# Altium project MZ7XB_Fun.PrjPCB
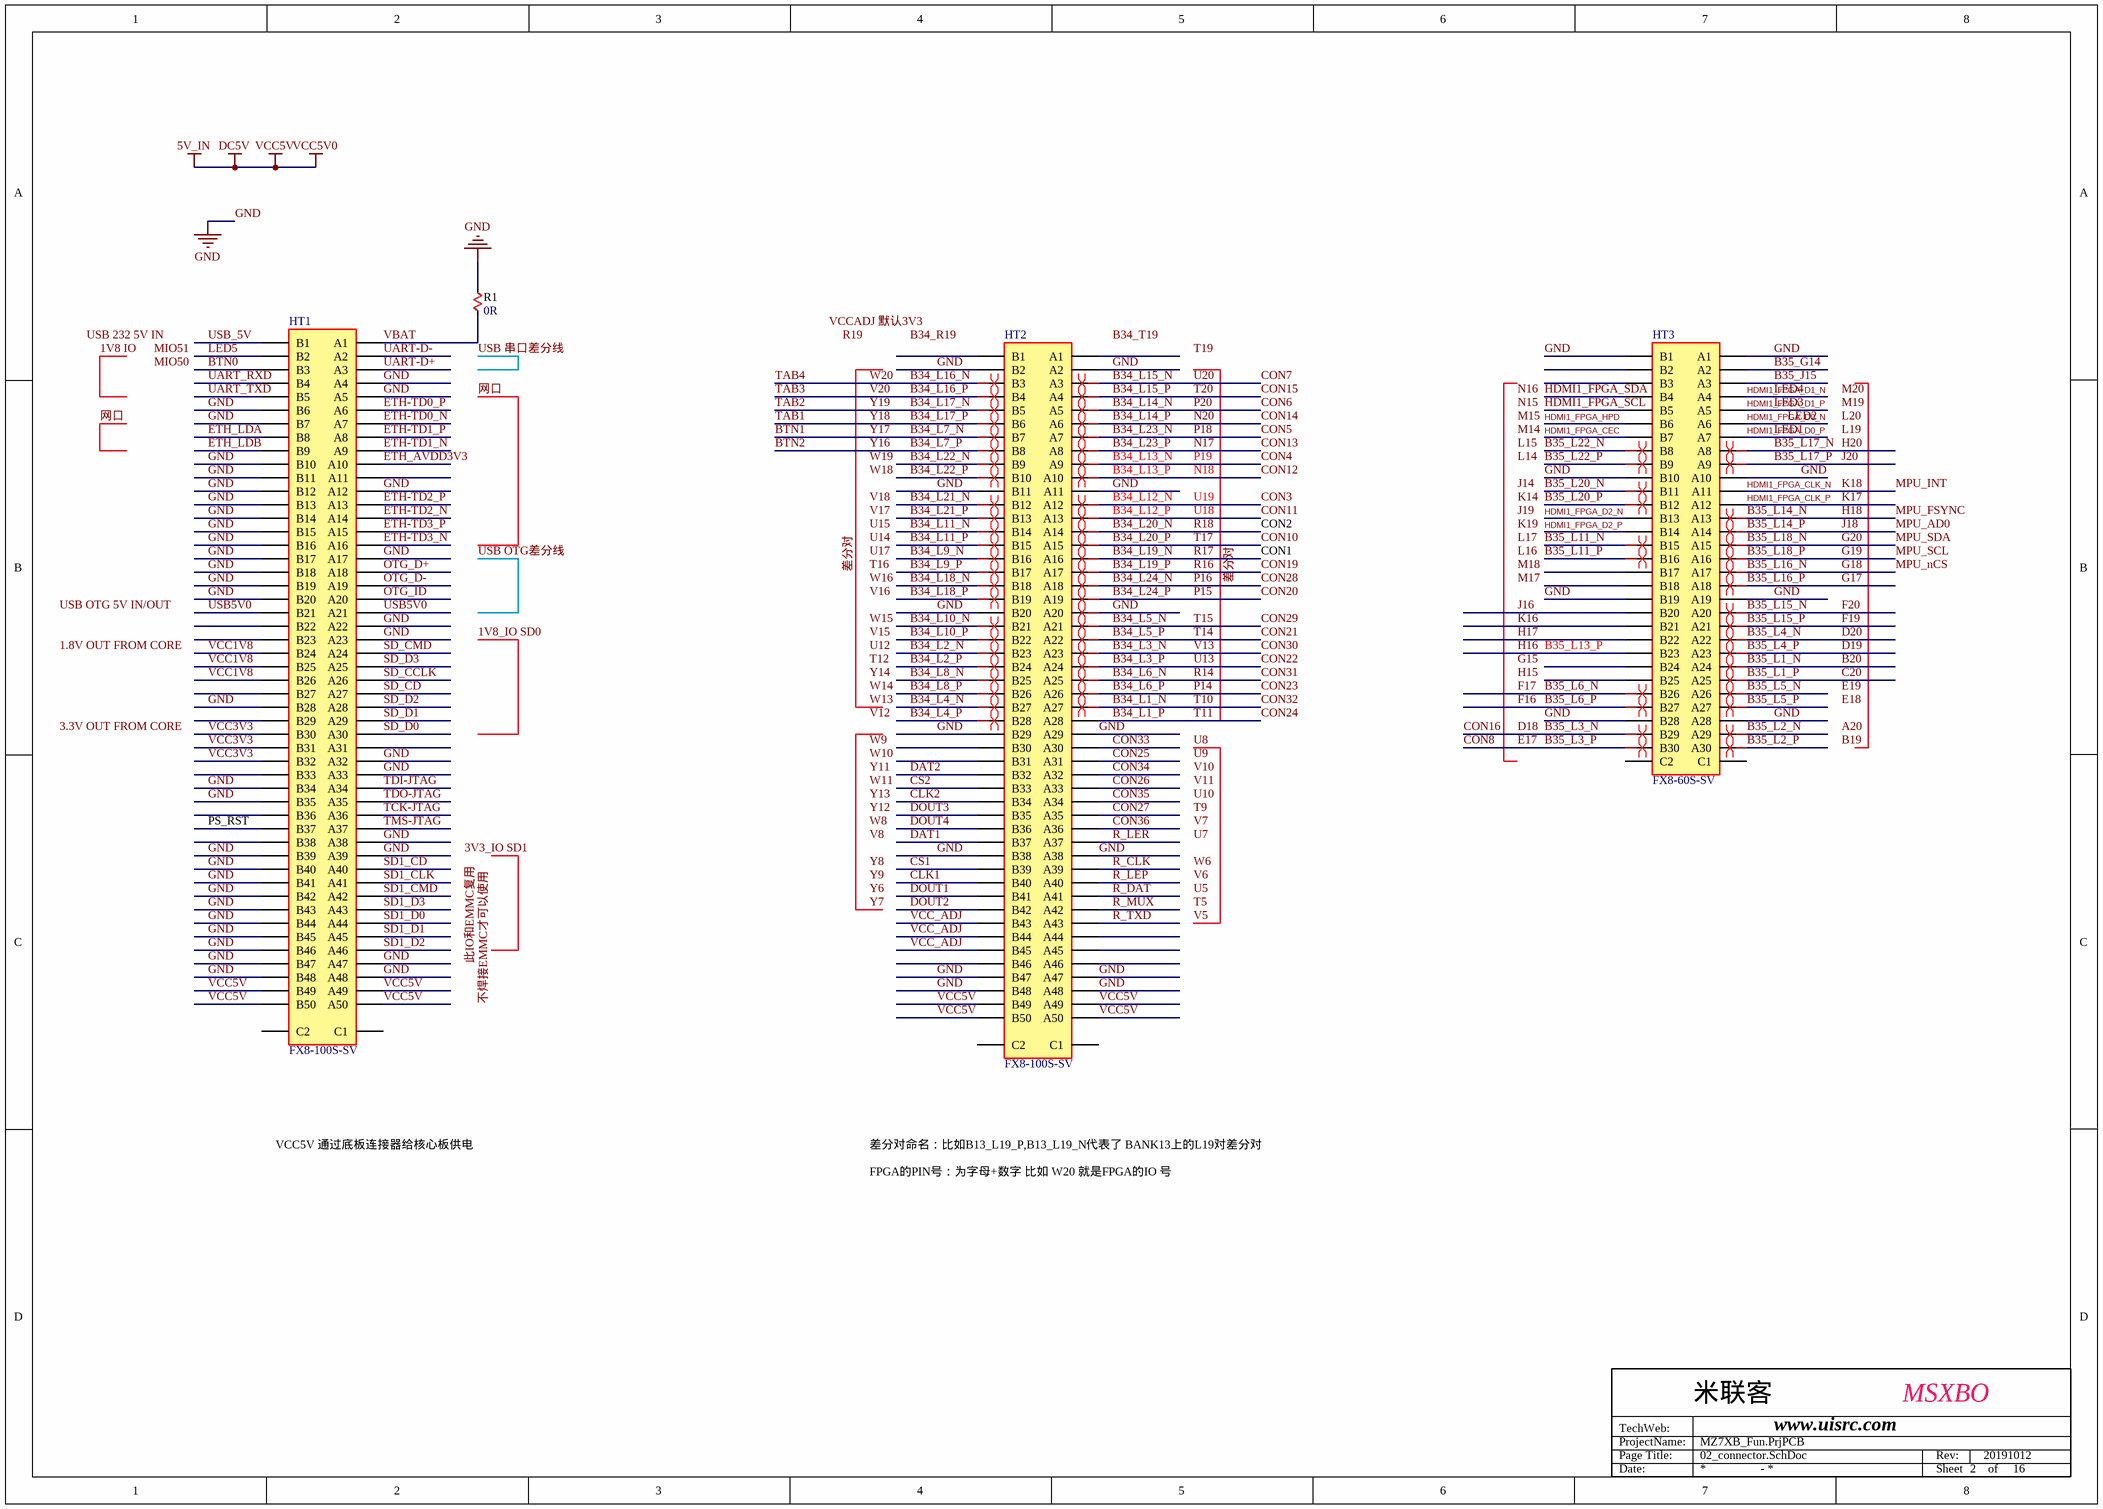
[diagram p0: 02_connector.SchDoc]
11 sheets, 87 parts. Net scope: global (net labels, ports and power ports of the same name join across sheets).
Board files: new.PcbDoc, new - 备份_未布线版本.PcbDoc
Sheets:
  02_connector.SchDoc
  05_USB_JTAG.SchDoc
  06_TF_CARD.SchDoc
  07_PS_ETH_RJ45.SchDoc
  11_BTN_LED_GPIO.SchDoc
  12_PLCLK_100M.SchDoc
  13_CEP.SchDoc
  Sheet1.SchDoc
  Sheet2.SchDoc
  10_HDMI_OUT.SchDoc
  15_PMU.SchDoc

## Sheet 02_connector.SchDoc
size A3

### Parts
HT1  FX8-100S-SV  [FX8-100S-SV92]
HT2  FX8-100S-SV  [FX8-100S-SV92]
HT3  FX8-60S-SV  [FX8-60S-SV92]
R1  0R  [R0603]

### Nets
GND: HT1.A4 HT1.A5 HT1.A12 HT1.A17 HT1.A22 HT1.A23 HT1.A32 HT1.A33 HT1.A38 HT1.A39 HT1.A47 HT1.A48 HT1.B6 HT1.B7 HT1.B10 HT1.B11 HT1.B12 HT1.B13 HT1.B14 HT1.B15 HT1.B16 HT1.B17 HT1.B18 HT1.B19 HT1.B20 HT1.B28 HT1.B34 HT1.B35 HT1.B39 HT1.B40 HT1.B41 HT1.B42 HT1.B43 HT1.B44 HT1.B45 HT1.B46 HT1.B47 HT1.B48 HT2.A2 HT2.A11 HT2.A20 HT2.A29 HT2.A38 HT2.A47 HT2.A48 HT2.B2 HT2.B11 HT2.B20 HT2.B29 HT2.B38 HT2.B47 HT2.B48 HT3.A1 HT3.A10 HT3.A19 HT3.A28 HT3.B1 HT3.B10 HT3.B19 HT3.B28 R1.1
VCC3V3: HT1.B30 HT1.B31 HT1.B32
VCC5V: HT1.A49 HT1.A50 HT1.B49 HT1.B50 HT2.A49 HT2.A50 HT2.B49 HT2.B50  [also labelled 5V_IN, DC5V, VCC5V0]
VCC_ADJ: HT2.B43 HT2.B44 HT2.B45
B20: HT3.A24  [also labelled B35_L1_N]
B34_L1_N: HT2.A27  [also labelled CON32, T10]
B34_L1_P: HT2.A28  [also labelled CON24, T11]
B34_L2_N: HT2.B23
B34_L2_P: HT2.B24
B34_L3_N: HT2.A23  [also labelled CON30, V13]
B34_L3_P: HT2.A24  [also labelled CON22, U13]
B34_L4_N: HT2.B27
B34_L4_P: HT2.B28
B34_L5_N: HT2.A21  [also labelled CON29, T15]
B34_L5_P: HT2.A22  [also labelled CON21, T14]
B34_L6_N: HT2.A25  [also labelled CON31, R14]
B34_L6_P: HT2.A26  [also labelled CON23, P14]
B34_L7_N: HT2.B7  [also labelled BTN1, Y17]
B34_L7_P: HT2.B8  [also labelled BTN2, Y16]
B34_L8_N: HT2.B25
B34_L8_P: HT2.B26
B34_L9_N: HT2.B16
B34_L9_P: HT2.B17
B34_L10_N: HT2.B21
B34_L10_P: HT2.B22
B34_L11_N: HT2.B14
B34_L11_P: HT2.B15
B34_L12_N: HT2.A12  [also labelled CON3, U19]
B34_L12_P: HT2.A13  [also labelled CON11, U18]
B34_L13_N: HT2.A9  [also labelled CON4, P19]
B34_L13_P: HT2.A10  [also labelled CON12, N18]
B34_L14_N: HT2.A5  [also labelled CON6, P20]
B34_L14_P: HT2.A6  [also labelled CON14, N20]
B34_L15_N: HT2.A3  [also labelled CON7, U20]
B34_L15_P: HT2.A4  [also labelled CON15, T20]
B34_L16_N: HT2.B3  [also labelled TAB4, W20]
B34_L16_P: HT2.B4  [also labelled TAB3, V20]
B34_L17_N: HT2.B5  [also labelled TAB2, Y19]
B34_L17_P: HT2.B6  [also labelled TAB1, Y18]
B34_L18_N: HT2.B18
B34_L18_P: HT2.B19
B34_L19_N: HT2.A16  [also labelled CON1, R17]
B34_L19_P: HT2.A17  [also labelled CON19, R16]
B34_L20_N: HT2.A14  [also labelled CON2, R18]
B34_L20_P: HT2.A15  [also labelled CON10, T17, 差分对]
B34_L21_N: HT2.B12
B34_L21_P: HT2.B13
B34_L22_N: HT2.B9
B34_L22_P: HT2.B10
B34_L23_N: HT2.A7  [also labelled CON5, P18]
B34_L23_P: HT2.A8  [also labelled CON13, N17]
B34_L24_N: HT2.A18  [also labelled CON28, P16]
B34_L24_P: HT2.A19  [also labelled CON20, P15]
B35_G14: HT3.A2
B35_J15: HT3.A3
B35_L1_P: HT3.A25  [also labelled C20]
B35_L2_N: HT3.A29
B35_L2_P: HT3.A30
B35_L3_N: HT3.B29  [also labelled CON16, D18]
B35_L3_P: HT3.B30  [also labelled CON8, E17]
B35_L4_N: HT3.A22  [also labelled D20]
B35_L4_P: HT3.A23  [also labelled D19]
B35_L5_N: HT3.A26
B35_L5_P: HT3.A27
B35_L6_N: HT3.B26  [also labelled F17]
B35_L6_P: HT3.B27  [also labelled F16]
B35_L11_N: HT3.B15
B35_L11_P: HT3.B16
B35_L13_P: HT3.B23  [also labelled H16]
B35_L14_N: HT3.A13  [also labelled H18, MPU_FSYNC]
B35_L14_P: HT3.A14  [also labelled J18, MPU_AD0]
B35_L15_N: HT3.A20  [also labelled F20]
B35_L15_P: HT3.A21  [also labelled F19]
B35_L16_N: HT3.A17  [also labelled G18, MPU_nCS]
B35_L16_P: HT3.A18  [also labelled G17]
B35_L17_N: HT3.A8  [also labelled H20]
B35_L17_P: HT3.A9  [also labelled J20]
B35_L18_N: HT3.A15  [also labelled G20, MPU_SDA]
B35_L18_P: HT3.A16  [also labelled G19, MPU_SCL]
B35_L20_N: HT3.B11
B35_L20_P: HT3.B12
B35_L22_N: HT3.B8
B35_L22_P: HT3.B9
BTN0: HT1.B3
CLK1: HT2.B40
CLK2: HT2.B34
CON25: HT2.A31
CON26: HT2.A33
CON27: HT2.A35
CON33: HT2.A30
CON34: HT2.A32
CON35: HT2.A34
CON36: HT2.A36
CS1: HT2.B39
CS2: HT2.B33
DAT1: HT2.B37
DAT2: HT2.B32
DOUT1: HT2.B41
DOUT2: HT2.B42
DOUT3: HT2.B35
DOUT4: HT2.B36
ETH-TD0_N: HT1.A7
ETH-TD0_P: HT1.A6
ETH-TD1_N: HT1.A9
ETH-TD1_P: HT1.A8
ETH-TD2_N: HT1.A14
ETH-TD2_P: HT1.A13
ETH-TD3_N: HT1.A16
ETH-TD3_P: HT1.A15
ETH_AVDD3V3: HT1.A10
ETH_LDA: HT1.B8
ETH_LDB: HT1.B9
H17: HT3.B22
HDMI1_FPGA_CEC: HT3.B7
HDMI1_FPGA_CLK_N: HT3.A11  [also labelled K18, MPU_INT]
HDMI1_FPGA_CLK_P: HT3.A12  [also labelled K17]
HDMI1_FPGA_D0_N: HT3.A6  [also labelled LED2]
HDMI1_FPGA_D0_P: HT3.A7  [also labelled LED1]
HDMI1_FPGA_D1_N: HT3.A4  [also labelled LED4]
HDMI1_FPGA_D1_P: HT3.A5  [also labelled LED3]
HDMI1_FPGA_D2_N: HT3.B13
HDMI1_FPGA_D2_P: HT3.B14
HDMI1_FPGA_HPD: HT3.B6
HDMI1_FPGA_SCL: HT3.B5
HDMI1_FPGA_SDA: HT3.B4
J16: HT3.B20
K16: HT3.B21
LED5: HT1.B2
OTG_D+: HT1.A18
OTG_D-: HT1.A19
OTG_ID: HT1.A20
PS_RST: HT1.B37
R_CLK: HT2.A39
R_DAT: HT2.A41
R_LEP: HT2.A40
R_LER: HT2.A37
R_MUX: HT2.A42
R_TXD: HT2.A43
SD1_CD: HT1.A40
SD1_CLK: HT1.A41
SD1_CMD: HT1.A42
SD1_D0: HT1.A44
SD1_D1: HT1.A45
SD1_D2: HT1.A46
SD1_D3: HT1.A43
SD_CCLK: HT1.A26
SD_CD: HT1.A27
SD_CMD: HT1.A24
SD_D0: HT1.A30
SD_D1: HT1.A29
SD_D2: HT1.A28
SD_D3: HT1.A25
TCK-JTAG: HT1.A36
TDI-JTAG: HT1.A34
TDO-JTAG: HT1.A35
TMS-JTAG: HT1.A37
UART-D+: HT1.A3
UART-D-: HT1.A2
UART_RXD: HT1.B4
UART_TXD: HT1.B5
USB5V0: HT1.A21 HT1.B21
USB_5V: HT1.B1
VBAT: HT1.A1 R1.2
VCC1V8: HT1.B24 HT1.B25 HT1.B26

Not connected (* = marked no-connect by the designer): HT1 A11 A31 B22 B23 B27 B29 B33 B36 B38 C1 C2; HT2 A1 A44 A45 A46 B1 B30 B31 B46 C1 C2; HT3 B2 B3 B17 B18 B24 B25 C1 C2

### Layout directives
differential pair: B20, B34_L1_N, B34_L2_N, B34_L2_P, B34_L3_N, B34_L3_P, B34_L4_N, B34_L4_P, B34_L5_N, B34_L5_P, B34_L6_N, B34_L6_P, B34_L7_N, B34_L7_P, B34_L8_N, B34_L8_P, B34_L9_N, B34_L9_P, B34_L10_N, B34_L10_P, B34_L11_N, B34_L11_P, B34_L12_N, B34_L12_P, B34_L13_N, B34_L13_P, B34_L14_N, B34_L14_P, B34_L15_N, B34_L15_P, B34_L16_N, B34_L16_P, B34_L17_N, B34_L17_P, B34_L18_N, B34_L18_P, B34_L19_N, B34_L19_P, B34_L20_N, B34_L20_P, B34_L21_N, B34_L21_P, B34_L22_N, B34_L22_P, B34_L23_N, B34_L23_P, B34_L24_N, B34_L24_P, B35_L1_P, B35_L2_N, B35_L2_P, B35_L3_N, B35_L3_P, B35_L4_N, B35_L4_P, B35_L5_N, B35_L5_P, B35_L6_N, B35_L6_P, B35_L11_N, B35_L11_P, B35_L14_N, B35_L14_P, B35_L15_N, B35_L15_P, B35_L16_N, B35_L16_P, B35_L17_N, B35_L17_P, B35_L18_N, B35_L18_P, B35_L20_N, B35_L20_P, B35_L22_N, B35_L22_P, GND

### Notes on the sheet
- VCC5V 通过底板连接器给核心板供电
- 差分对命名：比如B13_L19_P,B13_L19_N代表了 BANK13上的L19对差分对
- FPGA的PIN号：为字母+数字 比如 W20 就是FPGA的IO 号
- ProjectName:
- TechWeb:
- Page Title:
- 米联客
- www.uisrc.com
- MSXBO
- Rev:
- 20191012
- Date:
- -
- Sheet
- 2    of     16
- Labels drawn without touching a wire or pin: 1.8V OUT FROM CORE, 1V8 IO, 1V8_IO SD0, 3.3V OUT FROM CORE, 3V3_IO SD1, A20, B19, B34_R19, B34_T19, E18, E19, G15, H15, J14, J19, K14, K19, L14, L15, L16, L17, L19, L20, M14, M15, M17, M18, M19, M20, MIO50, MIO51, N15, N16, R19, T5, T9, T12, T16, T19, U5, U7, U8, U9, U10, U12, U14, U15, U17, USB 232 5V IN, USB OTG 5V IN/OUT, USB OTG差分线, USB 串口差分线, V5, V6, V7, V8, V10, V11, V12, V15, V16, V17, V18, VCCADJ 默认3V3, W6, W8, W9, W10, W11, W13, W14, W15, W16, W18, W19, Y6, Y7, Y8, Y9, Y11, Y12, Y13, Y14, 不焊接EMMC才可以使用, 差分对, 此IO和EMMC复用, 网口

### Library data of the parts
HT1 HT2 = FX8-100P-SV92
HT3 = FX8-60P-SV92
R1 = RESISTOR: Generic Resistor; Value: 390; Manufacturer: *; DPN: *

## Sheet 05_USB_JTAG.SchDoc
size A3
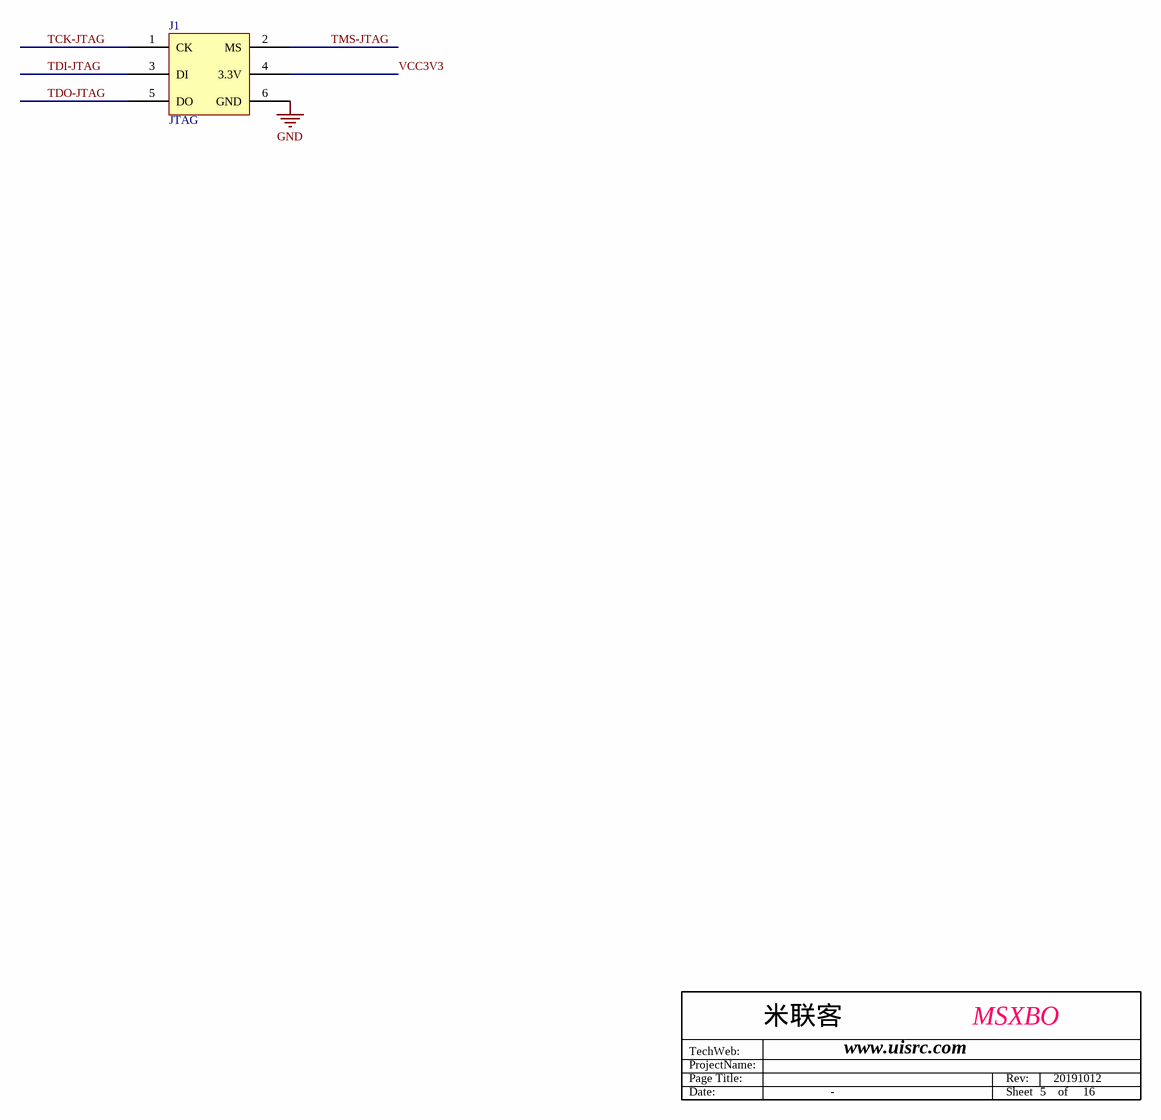
[diagram p1: 05_USB_JTAG.SchDoc]

### Parts
J1  JTAG  [2*3P]

### Nets
GND: J1.6(GND)
VCC3V3: J1.4(3.3V)
TCK-JTAG: J1.1(CK)
TDI-JTAG: J1.3(DI)
TDO-JTAG: J1.5(DO)
TMS-JTAG: J1.2(MS)

### Notes on the sheet
- ProjectName:
- TechWeb:
- Page Title:
- 米联客
- www.uisrc.com
- MSXBO
- Rev:
- 20191012
- Date:
- -
- Sheet
- 5    of     16

## Sheet 06_TF_CARD.SchDoc
size A4
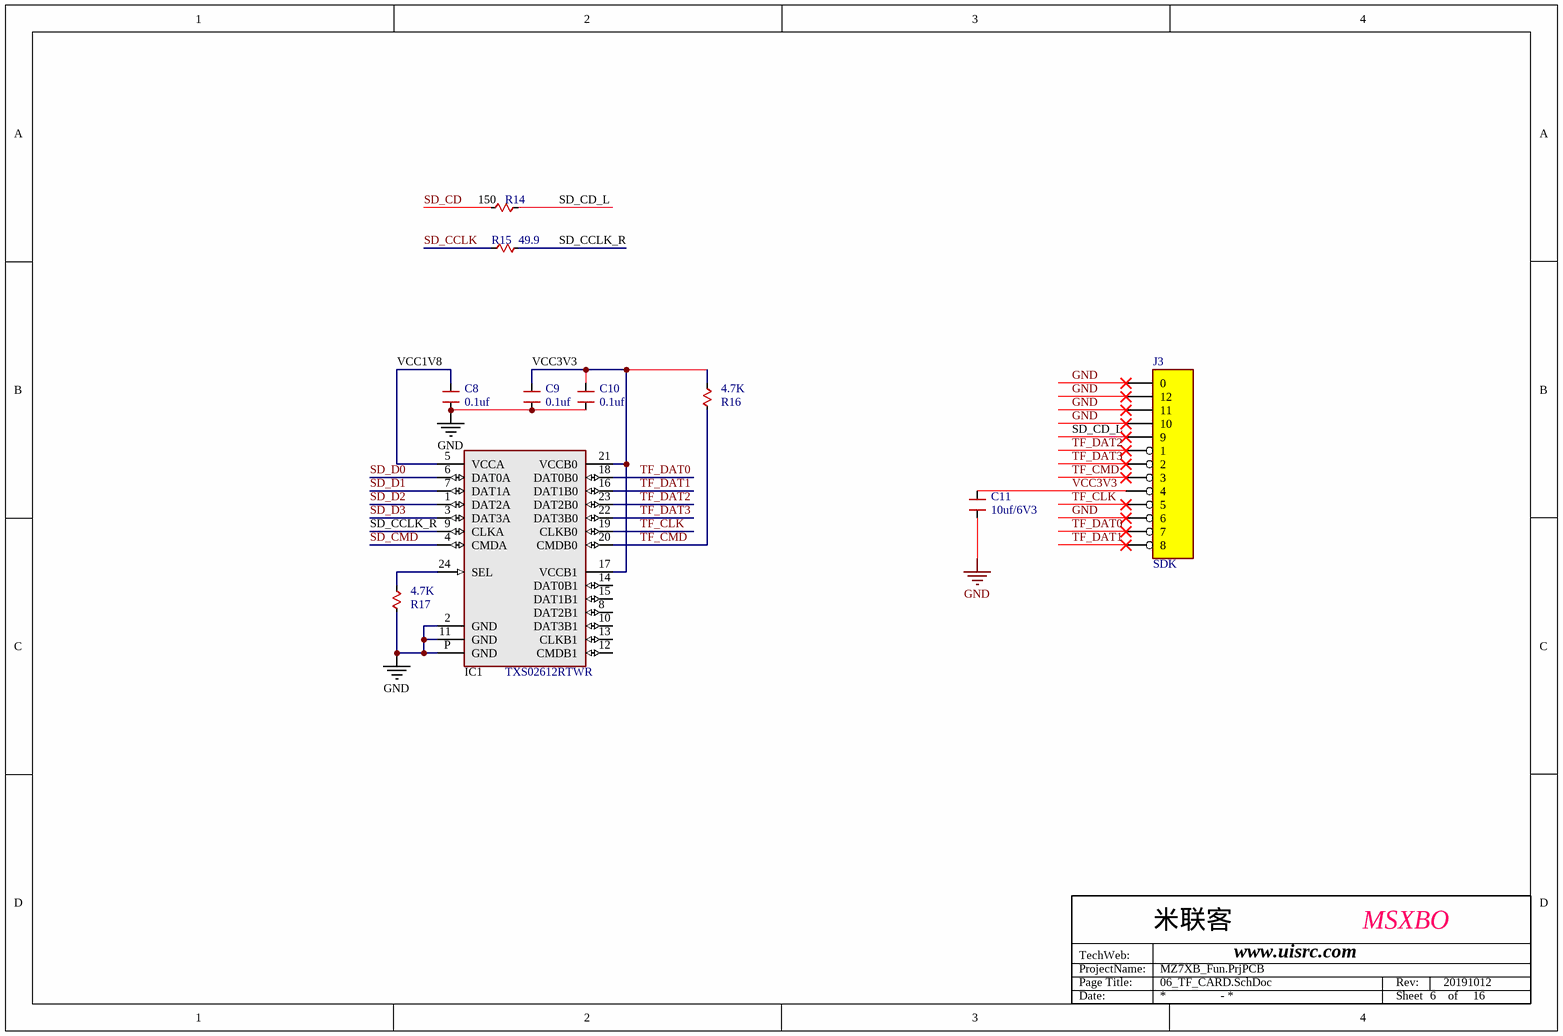
[diagram p2: 06_TF_CARD.SchDoc]

### Parts
(Parts that share a designator on the sheet are numbered #1, #2 ... from top to bottom, then left to right.)
C8  0.1uf  [CAP0603]
C9  0.1uf  [CAP0603]
C10  0.1uf  [CAP0603]
C11  10uf/6V3  [CAP0603]
IC1  TXS02612RTWR  [QFN24]
J3  SDK  [TF_K]
R14  value 150  [R0603]  (hidden comment: 150R)
R15#1  49.9  [R0603]
R16  4.7K  [R0603]
R17#1  4.7K  [R0603]

### Nets
GND: C8.2 C9.2 C10.2 C11.2 IC1.2(GND) IC1.11(GND) IC1.P(GND) J3.0 J3.6 J3.10 J3.11 J3.12 R17#1.1
VCC3V3: C9.1 C10.1 C11.1 IC1.17(VCCB1) IC1.21(VCCB0) J3.4 R16.2
SD_CCLK: R15#1.2
SD_CCLK_R: IC1.9(CLKA) R15#1.1
SD_CD: R14.1
SD_CD_L: J3.9 R14.2
SD_CMD: IC1.4(CMDA)
SD_D0: IC1.6(DAT0A)
SD_D1: IC1.7(DAT1A)
SD_D2: IC1.1(DAT2A)
SD_D3: IC1.3(DAT3A)
TF_CLK: IC1.19(CLKB0) J3.5
TF_CMD: IC1.20(CMDB0) J3.3 R16.1
TF_DAT0: IC1.18(DAT0B0) J3.7
TF_DAT1: IC1.16(DAT1B0) J3.8
TF_DAT2: IC1.23(DAT2B0) J3.1
TF_DAT3: IC1.22(DAT3B0) J3.2
VCC1V8: C8.1 IC1.5(VCCA)
NetIC1_24: IC1.24(SEL) R17#1.2

Not connected (* = marked no-connect by the designer): IC1 8(DAT2B1) 10(DAT3B1) 12(CMDB1) 13(CLKB1) 14(DAT0B1) 15(DAT1B1)

### Notes on the sheet
- ProjectName:
- TechWeb:
- Page Title:
- 米联客
- www.uisrc.com
- MSXBO
- Rev:
- 20191012
- Date:
- -
- Sheet
- 6    of     16

### Library data of the parts
C8-C10 = CAPACITOR: Generic Capacitor; DPN: *; Manufacturer: *; Value: 0.1uF
C11 = CAPACITOR: Generic Capacitor; Value: 4.7uF; DPN: *; Manufacturer: *
IC1 = TXS02612: SDIO Port Expander with Voltage-Level Translation; Manufacturer: Texas Instruments; DPN: *
J3 = SD
R14 R16 R17#1 = RESISTOR: Generic Resistor; Manufacturer: *; DPN: *
  R16 R17#1: Value: 4.7K
R15#1 = RESISTOR: LoadStatus: Load; Manufacturer: *; DPN: *; Value: 49.9

## Sheet 07_PS_ETH_RJ45.SchDoc
size A4
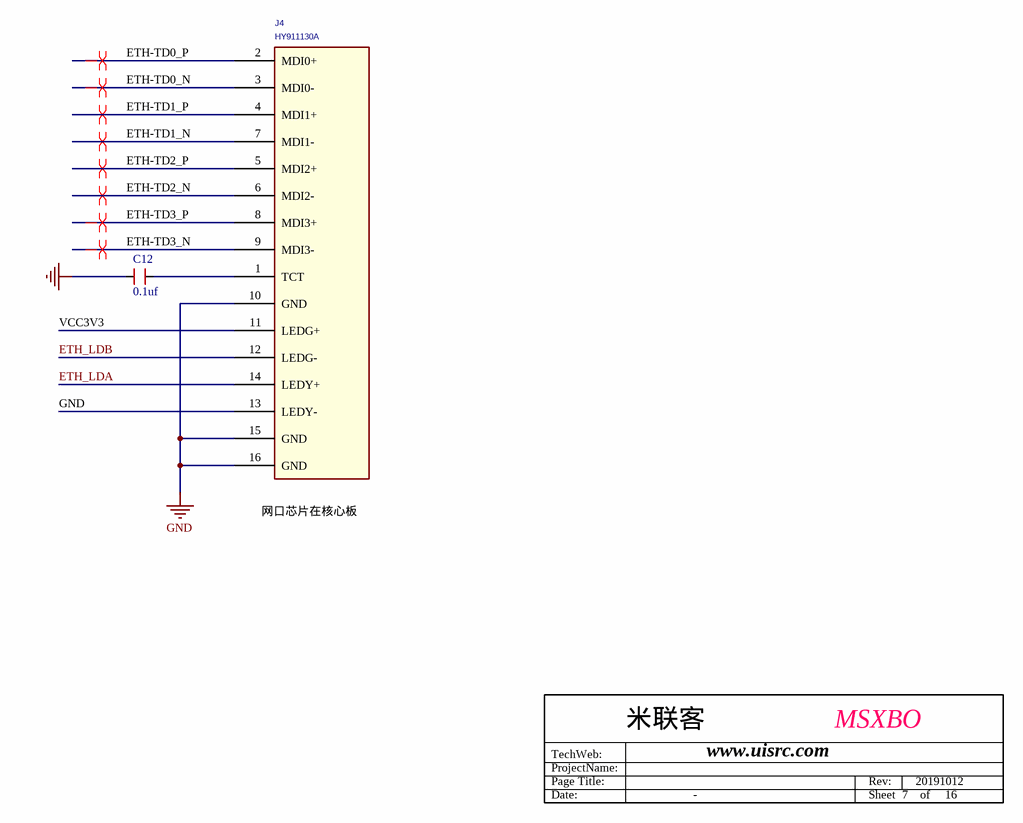
[diagram p3: 07_PS_ETH_RJ45.SchDoc]

### Parts
C12  0.1uf  [CAP0603]
J4  HY911130A  [HY911130A]

### Nets
GND: C12.1 J4.10(GND) J4.13(LEDY-) J4.15(GND) J4.16(GND)
VCC3V3: J4.11(LEDG+)
ETH-TD0_N: J4.3(MDI0-)
ETH-TD0_P: J4.2(MDI0+)
ETH-TD1_N: J4.7(MDI1-)
ETH-TD1_P: J4.4(MDI1+)
ETH-TD2_N: J4.6(MDI2-)
ETH-TD2_P: J4.5(MDI2+)
ETH-TD3_N: J4.9(MDI3-)
ETH-TD3_P: J4.8(MDI3+)
ETH_LDA: J4.14(LEDY+)
ETH_LDB: J4.12(LEDG-)
NetC12_2: C12.2 J4.1(TCT)

### Layout directives
differential pair: ETH-TD0_N, ETH-TD0_P, ETH-TD1_N, ETH-TD1_P, ETH-TD2_N, ETH-TD2_P, ETH-TD3_N, ETH-TD3_P

### Notes on the sheet
- (near J4) 网口芯片在核心板
- ProjectName:
- TechWeb:
- Page Title:
- 米联客
- www.uisrc.com
- MSXBO
- Rev:
- 20191012
- Date:
- -
- Sheet
- 7    of     16

### Library data of the parts
C12 = CAPACITOR: Generic Capacitor; DPN: *; Manufacturer: *

## Sheet 11_BTN_LED_GPIO.SchDoc
size A3
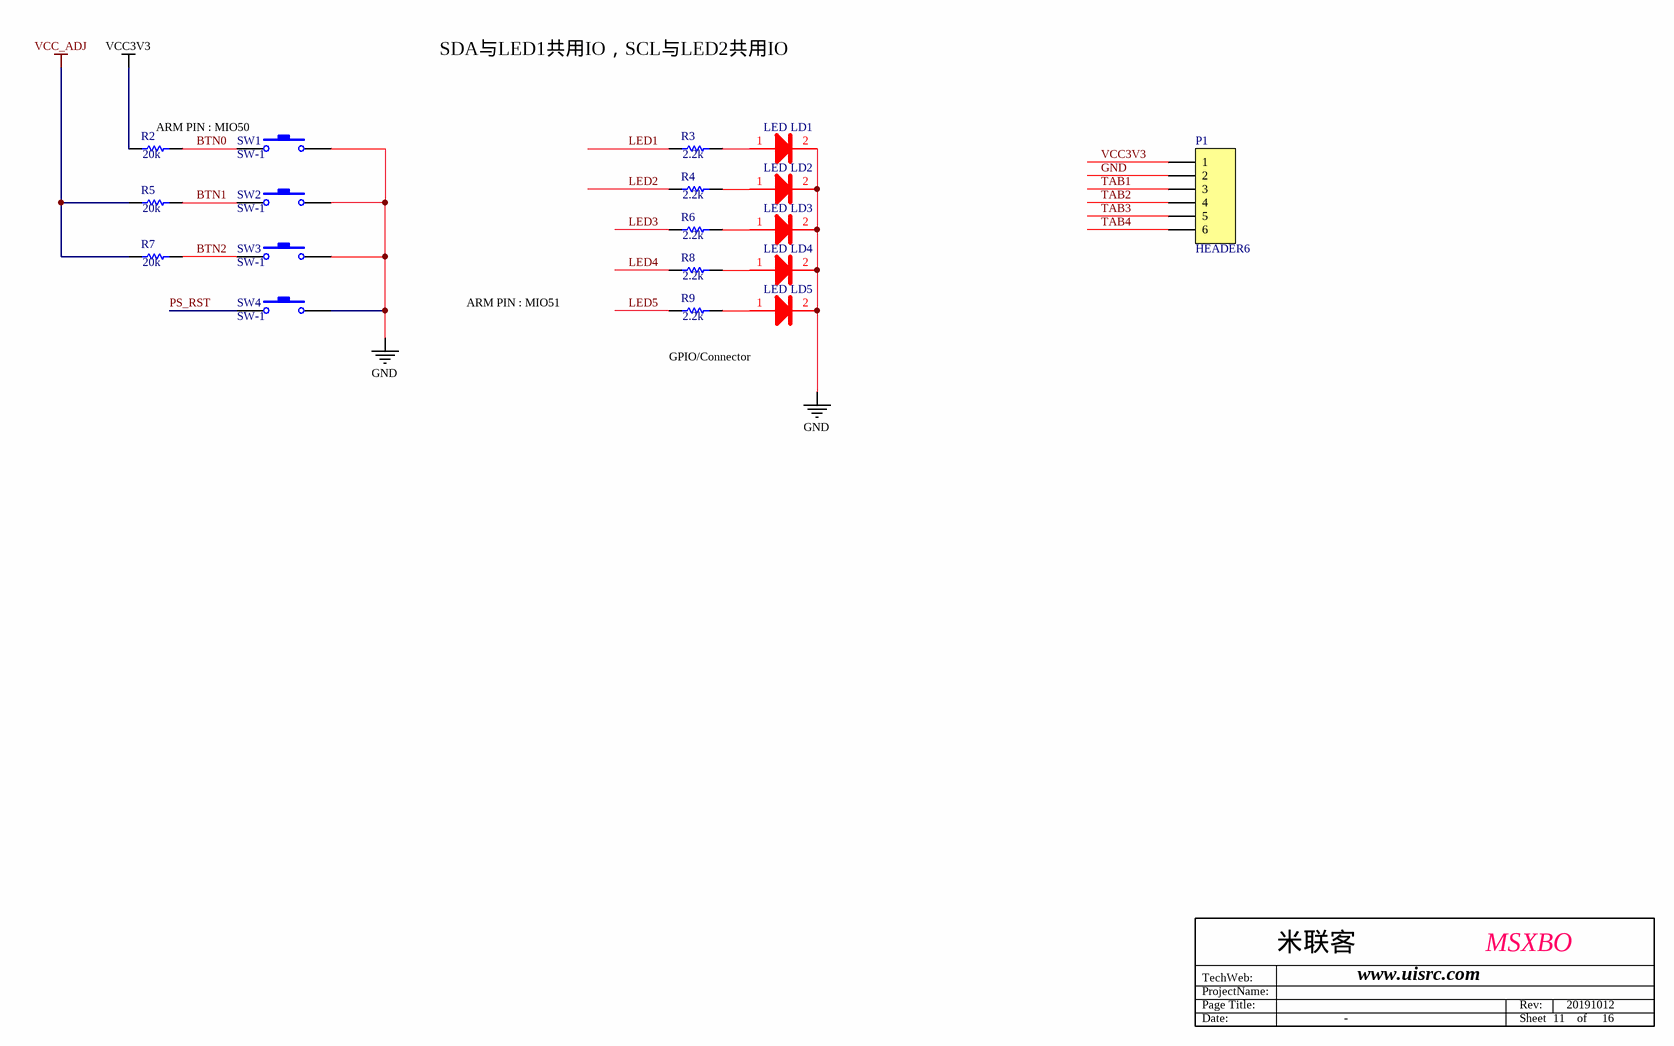
[diagram p4: 11_BTN_LED_GPIO.SchDoc]

### Parts
(Parts that share a designator on the sheet are numbered #1, #2 ... from top to bottom, then left to right.)
LD1  LED  [0603D]
LD2  LED  [0603D]
LD3  LED  [0603D]
LD4  LED  [0603D]
LD5  LED  [0603D]
P1  HEADER6  [HEADER1X6]
R2  20k  [R0603]
R3  2.2k  [R0603]
R4  2.2k  [R0603]
R5  20k  [R0603]
R6#1  2.2k  [R0603]
R7#1  20k  [R0603]
R8#1  2.2k  [R0603]
R9  2.2k  [R0603]
SW1  SW-1  [SW-3X9]
SW2  SW-1  [SW-3X9]
SW3  SW-1  [SW-3X9]
SW4  SW-1  [SW-3X9]

### Nets
GND: LD1.2 LD2.2 LD3.2 LD4.2 LD5.2 P1.2 SW1.2 SW2.2 SW3.2 SW4.2
VCC3V3: P1.1 R2.2
VCC_ADJ: R5.2 R7#1.2
BTN0: R2.1 SW1.1
BTN1: R5.1 SW2.1  [project net B34_L7_N]
BTN2: R7#1.1 SW3.1  [project net B34_L7_P]
LED1: R3.2  [project net HDMI1_FPGA_D0_P]
LED2: R4.2  [project net HDMI1_FPGA_D0_N]
LED3: R6#1.2  [project net HDMI1_FPGA_D1_P]
LED4: R8#1.2  [project net HDMI1_FPGA_D1_N]
LED5: R9.2
PS_RST: SW4.1
TAB1: P1.3  [project net B34_L17_P]
TAB2: P1.4  [project net B34_L17_N]
TAB3: P1.5  [project net B34_L16_P]
TAB4: P1.6  [project net B34_L16_N]
NetLD1_1: LD1.1 R3.1
NetLD2_1: LD2.1 R4.1
NetLD3_1: LD3.1 R6#1.1
NetLD4_1: LD4.1 R8#1.1
NetLD5_1: LD5.1 R9.1

### Notes on the sheet
- SDA与LED1共用IO，SCL与LED2共用IO
- ARM PIN : MIO50
- ARM PIN : MIO51
- GPIO/Connector
- ProjectName:
- TechWeb:
- Page Title:
- 米联客
- www.uisrc.com
- MSXBO
- Rev:
- 20191012
- Date:
- -
- Sheet
- 11    of     16

### Library data of the parts
LD1-LD5 = LEDR
R2-R5 R6#1 R7#1 R8#1 R9 = Res: 1K
SW1-SW4 = SW-1: SW

## Sheet 12_PLCLK_100M.SchDoc
size A4
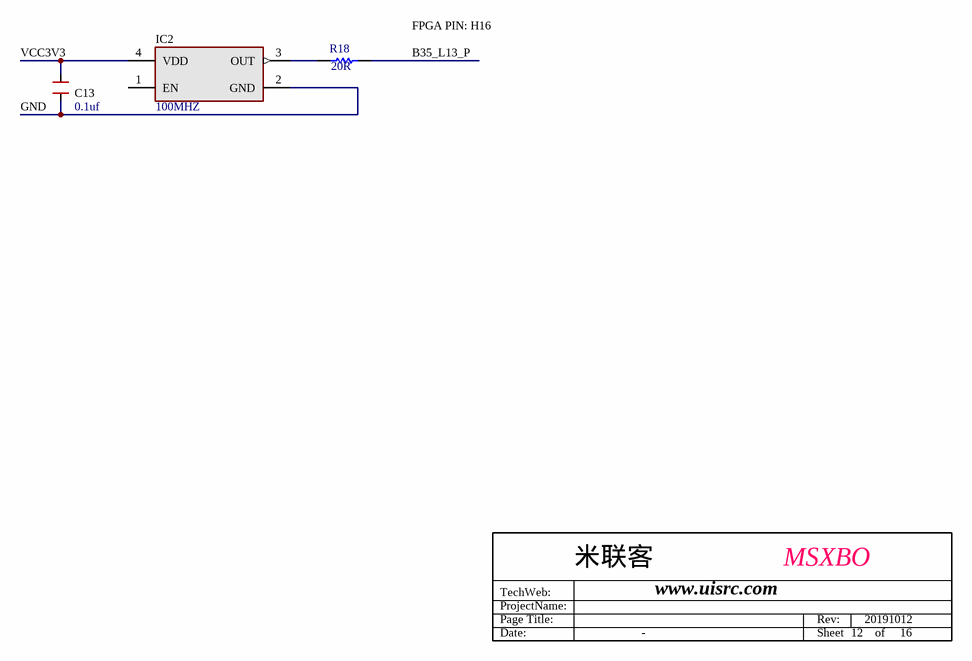
[diagram p5: 12_PLCLK_100M.SchDoc]

### Parts
(Parts that share a designator on the sheet are numbered #1, #2 ... from top to bottom, then left to right.)
C13  0.1uf  [CAP0603]
IC2  100MHZ  [3225]
R18#1  20R  [R0603]

### Nets
GND: C13.2 IC2.2(GND)
VCC3V3: C13.1 IC2.4(VDD)
B35_L13_P: R18#1.1
NetIC2_3: IC2.3(OUT) R18#1.2

Not connected (* = marked no-connect by the designer): IC2 1(EN)

### Notes on the sheet
- FPGA PIN: H16
- ProjectName:
- TechWeb:
- Page Title:
- 米联客
- www.uisrc.com
- MSXBO
- Rev:
- 20191012
- Date:
- -
- Sheet
- 12    of     16

### Library data of the parts
C13 = CAPACITOR: Generic Capacitor; Value: 10nF; DPN: *; Manufacturer: *
IC2 = FXO-HC5: 3.3V HCMOS Oscillator; Manufacturer: Fox Electronics; Value: 26MHz; DPN: *
R18#1 = Res: 1K

## Sheet 13_CEP.SchDoc
size A3
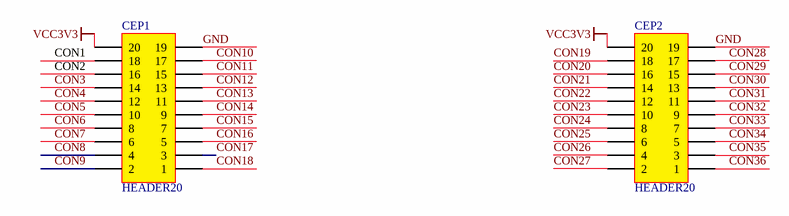
[diagram p6: 13_CEP.SchDoc]

### Parts
CEP1  HEADER20  [HEADER10X2X2.5]
CEP2  HEADER20  [HEADER10X2X2.5]

### Nets
GND: CEP1.19 CEP2.19
VCC3V3: CEP1.20 CEP2.20
CON1: CEP1.18  [project net B34_L19_N]
CON2: CEP1.16  [project net B34_L20_N]
CON3: CEP1.14  [project net B34_L12_N]
CON4: CEP1.12  [project net B34_L13_N]
CON5: CEP1.10  [project net B34_L23_N]
CON6: CEP1.8  [project net B34_L14_N]
CON7: CEP1.6  [project net B34_L15_N]
CON8: CEP1.4  [project net B35_L3_P]
CON9: CEP1.2
CON10: CEP1.17  [project net B34_L20_P]
CON11: CEP1.15  [project net B34_L12_P]
CON12: CEP1.13  [project net B34_L13_P]
CON13: CEP1.11  [project net B34_L23_P]
CON14: CEP1.9  [project net B34_L14_P]
CON15: CEP1.7  [project net B34_L15_P]
CON16: CEP1.5  [project net B35_L3_N]
CON17: CEP1.3
CON18: CEP1.1
CON19: CEP2.18  [project net B34_L19_P]
CON20: CEP2.16  [project net B34_L24_P]
CON21: CEP2.14  [project net B34_L5_P]
CON22: CEP2.12  [project net B34_L3_P]
CON23: CEP2.10  [project net B34_L6_P]
CON24: CEP2.8  [project net B34_L1_P]
CON25: CEP2.6
CON26: CEP2.4
CON27: CEP2.2
CON28: CEP2.17  [project net B34_L24_N]
CON29: CEP2.15  [project net B34_L5_N]
CON30: CEP2.13  [project net B34_L3_N]
CON31: CEP2.11  [project net B34_L6_N]
CON32: CEP2.9  [project net B34_L1_N]
CON33: CEP2.7
CON34: CEP2.5
CON35: CEP2.3
CON36: CEP2.1

### Library data of the parts
CEP1 CEP2 = HEADER10X2

## Sheet Sheet1.SchDoc
size A4
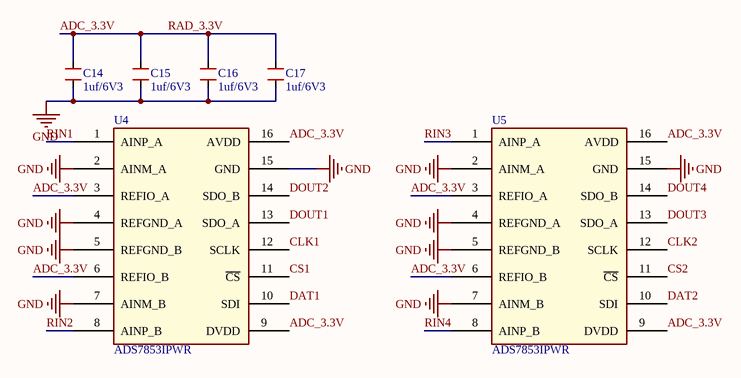
[diagram p7: Sheet1.SchDoc]

### Parts
C14  1uf/6V3  [CAP0603]
C15  1uf/6V3  [CAP0603]
C16  1uf/6V3  [CAP0603]
C17  1uf/6V3  [CAP0603]
U4  ADS7853IPWR  [TSSOP16-0.65-5X4.4MM]
U5  ADS7853IPWR  [TSSOP16-0.65-5X4.4MM]

### Nets
GND: C14.2 C15.2 C16.2 C17.2 U4.2(AINM_A) U4.4(REFGND_A) U4.5(REFGND_B) U4.7(AINM_B) U4.15(GND) U5.2(AINM_A) U5.4(REFGND_A) U5.5(REFGND_B) U5.7(AINM_B) U5.15(GND)
ADC_3.3V: C14.1 C15.1 C16.1 C17.1 U4.3(REFIO_A) U4.6(REFIO_B) U4.9(DVDD) U4.16(AVDD) U5.3(REFIO_A) U5.6(REFIO_B) U5.9(DVDD) U5.16(AVDD)  [also labelled RAD_3.3V]
CLK1: U4.12(SCLK)
CLK2: U5.12(SCLK)
CS1: U4.11(~{CS})
CS2: U5.11(~{CS})
DAT1: U4.10(SDI)
DAT2: U5.10(SDI)
DOUT1: U4.13(SDO_A)
DOUT2: U4.14(SDO_B)
DOUT3: U5.13(SDO_A)
DOUT4: U5.14(SDO_B)
RIN1: U4.1(AINP_A)
RIN2: U4.8(AINP_B)
RIN3: U5.1(AINP_A)
RIN4: U5.8(AINP_B)

### Library data of the parts
C14-C17 = CAPACITOR_1UF: Generic Capacitor; Value: 4.7uF; DPN: *; Manufacturer: *

## Sheet Sheet2.SchDoc
size A4
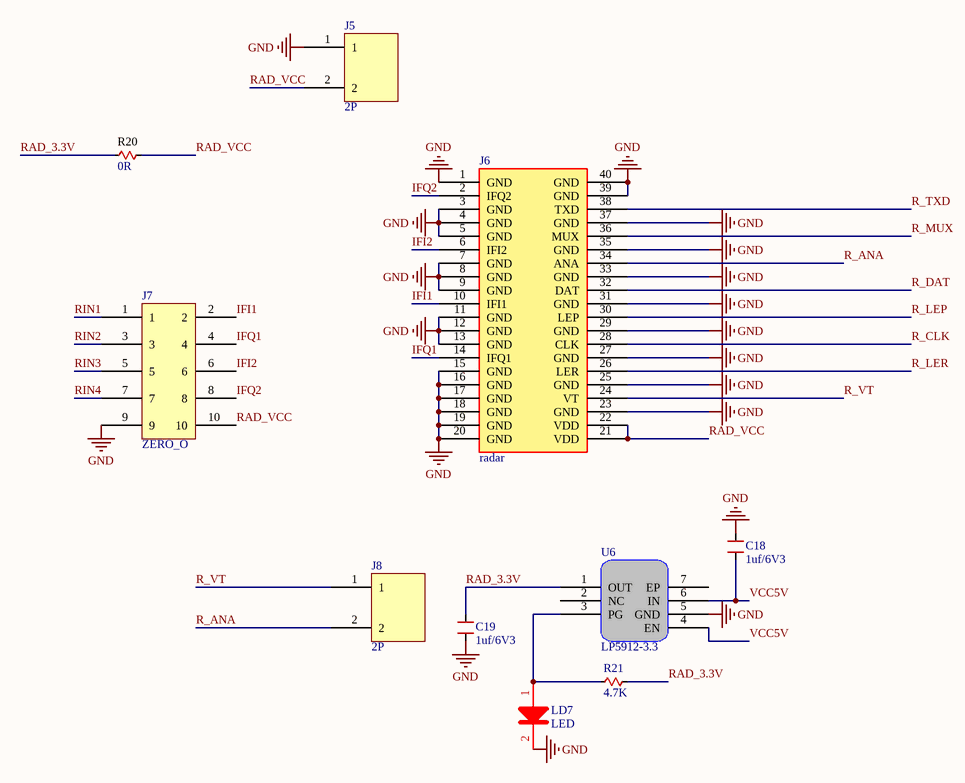
[diagram p8: Sheet2.SchDoc]

### Parts
C18  1uf/6V3  [CAP0603]
C19  1uf/6V3  [CAP0603]
J5  2P  [2P]
J6  radar  [BTB_40P_0.8_G]
J7  ZERO_O  [2*5P]
J8  2P  [2P]
LD7  LED  [0603D]
R20  0R  [R0603]
R21  4.7K  [R0603]
U6  LP5912-3.3  [WSON-6_L2.0-W2.0-P0.65-TL-EP]

### Nets
GND: C18.1 C19.2 J5.1 J6.1(GND) J6.3(GND) J6.4(GND) J6.5(GND) J6.7(GND) J6.8(GND) J6.9(GND) J6.11(GND) J6.12(GND) J6.13(GND) J6.15(GND) J6.16(GND) J6.17(GND) J6.18(GND) J6.19(GND) J6.20(GND) J6.23(GND) J6.25(GND) J6.27(GND) J6.29(GND) J6.31(GND) J6.33(GND) J6.35(GND) J6.37(GND) J6.39(GND) J6.40(GND) J7.9 LD7.2 U6.5(GND)
VCC5V: C18.2 U6.4(EN) U6.6(IN)
IFI1: J6.10(IFI1) J7.2
IFI2: J6.6(IFI2) J7.6
IFQ1: J6.14(IFQ1) J7.4
IFQ2: J6.2(IFQ2) J7.8
R_ANA: J6.34(ANA) J8.2
R_CLK: J6.28(CLK)
R_DAT: J6.32(DAT)
R_LEP: J6.30(LEP)
R_LER: J6.26(LER)
R_MUX: J6.36(MUX)
R_TXD: J6.38(TXD)
R_VT: J6.24(VT) J8.1
RAD_3.3V: C19.1 R20.1 R21.2 U6.1(OUT)  [project net ADC_3.3V]
RAD_VCC: J5.2 J6.21(VDD) J6.22(VDD) J7.10 R20.2
RIN1: J7.1
RIN2: J7.3
RIN3: J7.5
RIN4: J7.7
NetLD7_1: LD7.1 R21.1 U6.3(PG)

Not connected (* = marked no-connect by the designer): U6 2(NC) 7(EP)

### Library data of the parts
C18 C19 = CAPACITOR_1UF: Generic Capacitor; Value: 4.7uF; DPN: *; Manufacturer: *
LD7 = LEDR
R20 = RESISTOR: Generic Resistor; Value: 390; Manufacturer: *; DPN: *
R21 = RESISTOR: Generic Resistor; Manufacturer: *; DPN: *; Value: 4.7K

## Sheet 10_HDMI_OUT.SchDoc
size A3
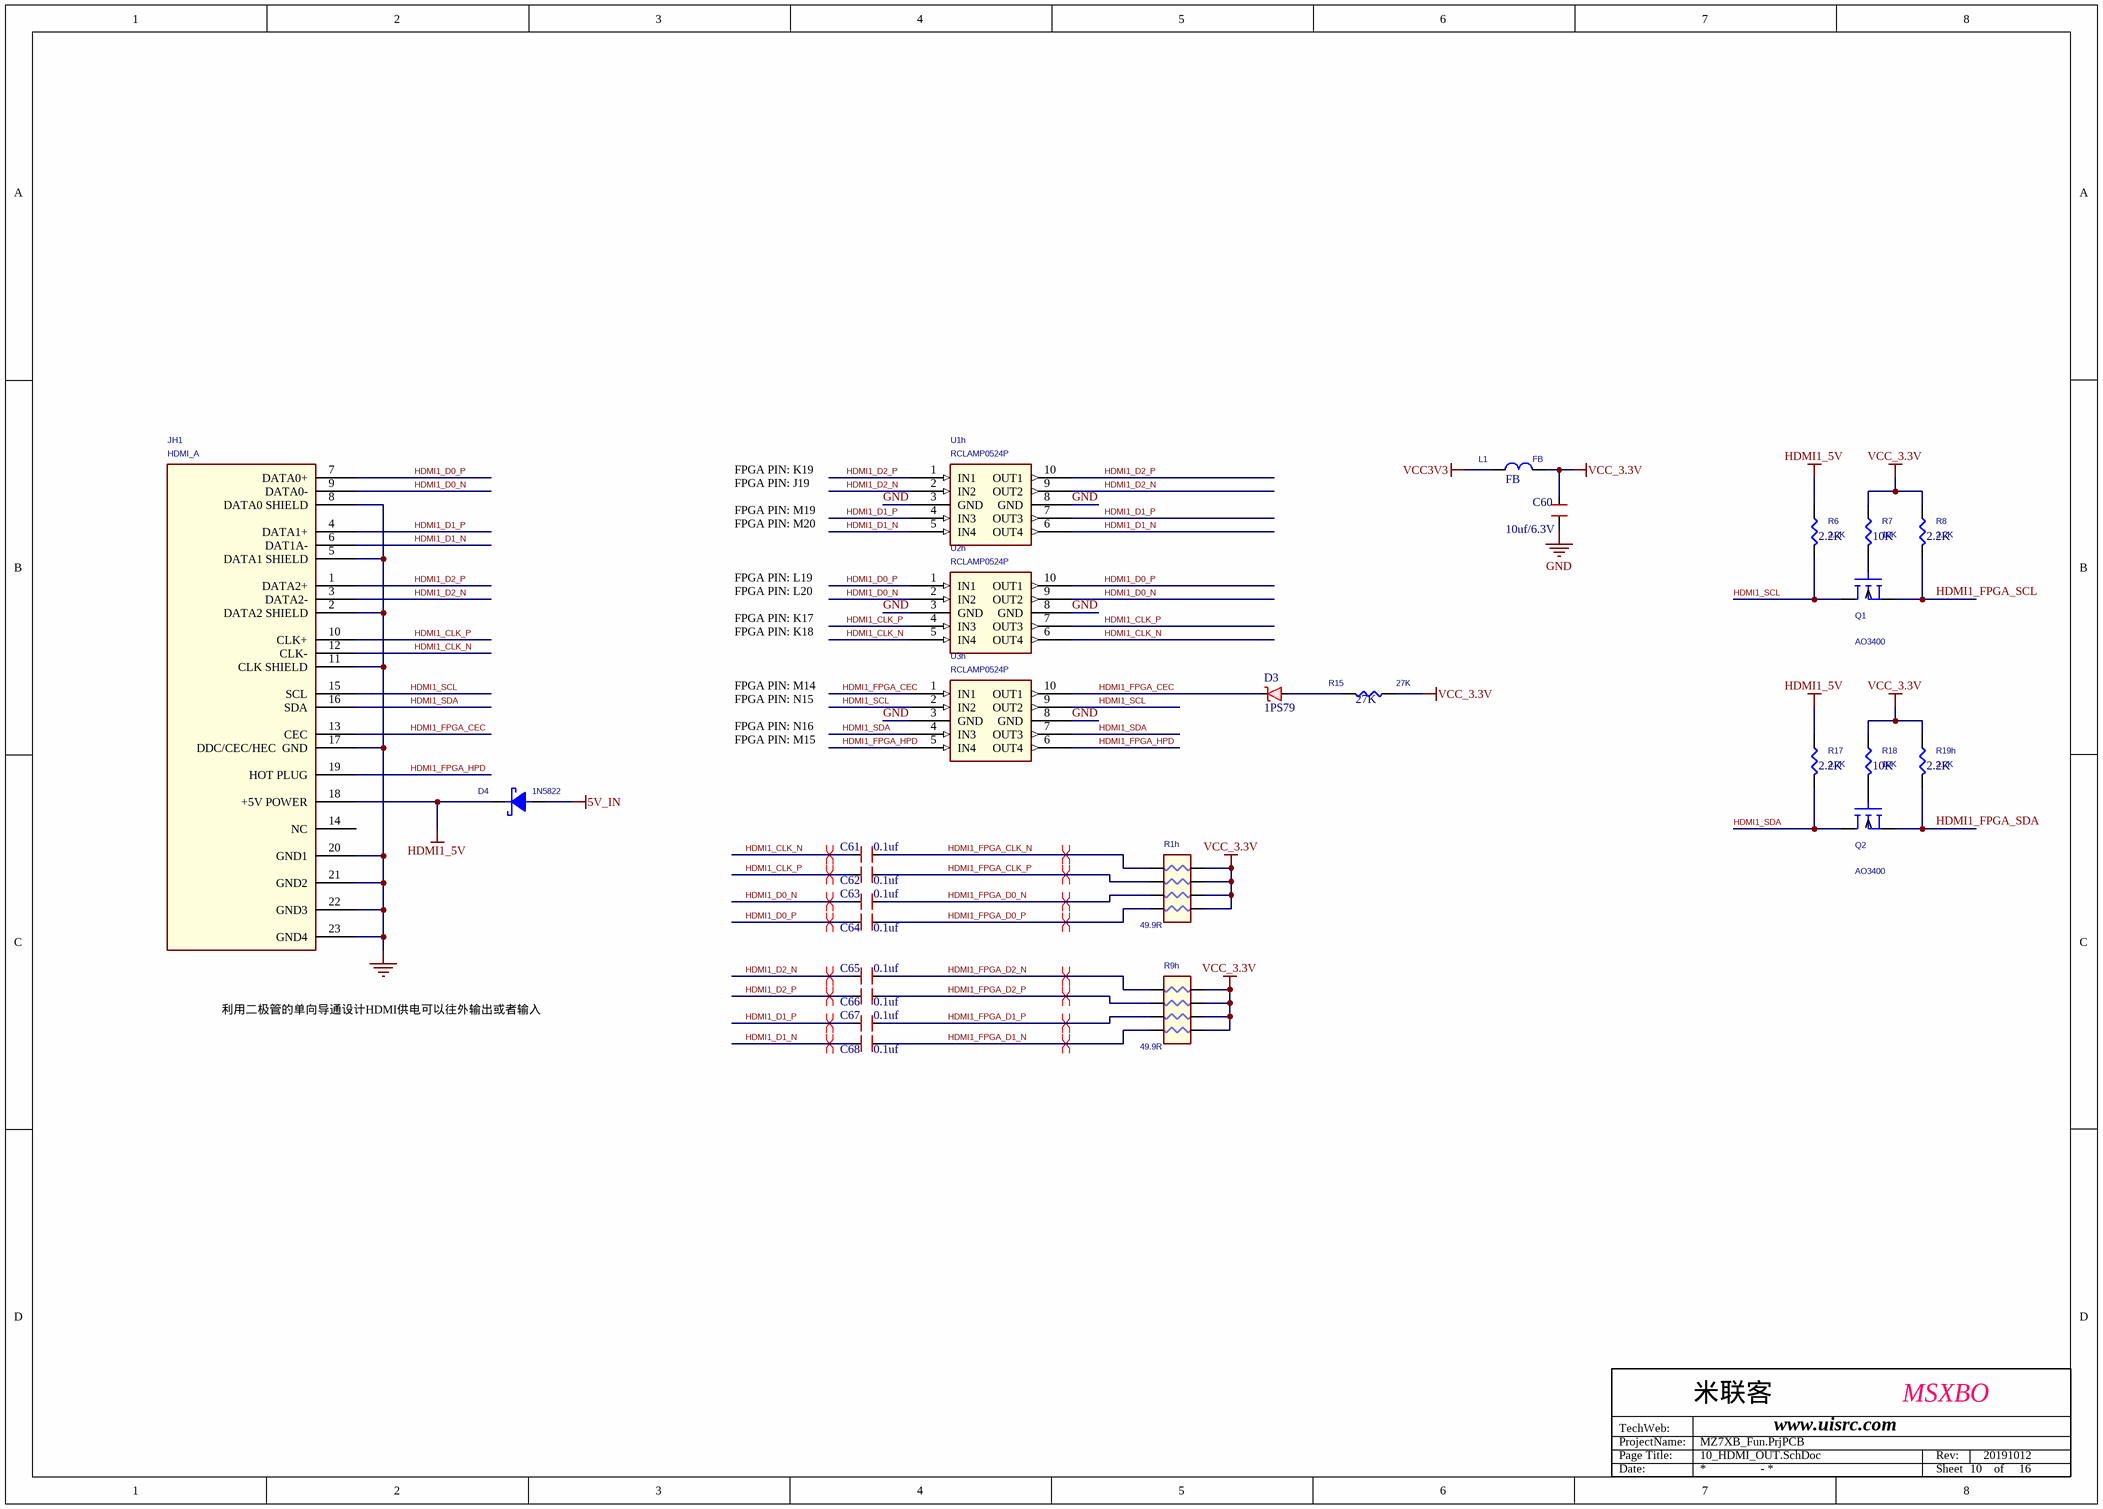
[diagram p9: 10_HDMI_OUT.SchDoc]

### Parts
(Parts that share a designator on the sheet are numbered #1, #2 ... from top to bottom, then left to right.)
C60  10uf/6.3V  [CAP0805]
C61  0.1uf  [CAP0402]
C62  0.1uf  [CAP0402]
C63  0.1uf  [CAP0402]
C64  0.1uf  [CAP0402]
C65  0.1uf  [CAP0402]
C66  0.1uf  [CAP0402]
C67  0.1uf  [CAP0402]
C68  0.1uf  [CAP0402]
D3  1PS79  [SOD-523]
D4  1N5822  [SMA_DO_214AC]
JH1  HDMI_A  [HDMI_1903015]
L1  FB  [CAP0603]
Q1  AO3400  [SOT23]
Q2  AO3400  [SOT23]
R1h  49.9R  [RA4_0603]
R6#2  2.2K  [RES0402]
R7#2  10K  [RES0402]
R8#2  2.2K  [RES0402]
R9h  49.9R  [RA4_0603]
R15#2  27K  [RES0402]
R17#2  2.2K  [RES0402]
R18#2  10K  [RES0402]
R19h  2.2K  [RES0402]
U1h  RCLAMP0524P  [SLP2510P8_10]
U2h  RCLAMP0524P  [SLP2510P8_10]
U3h  RCLAMP0524P  [SLP2510P8_10]

### Nets
5V_IN: D4.1(A)  [project net VCC5V]
GND: C60.2 JH1.2(DATA2_SHIELD) JH1.5(DATA1_SHIELD) JH1.8(DATA0_SHIELD) JH1.11(CLK_SHIELD) JH1.17(DDC/CEC/HEC__GND) JH1.20(GND1) JH1.21(GND2) JH1.22(GND3) JH1.23(GND4) U1h.3(GND) U1h.8(GND) U2h.3(GND) U2h.8(GND) U3h.3(GND) U3h.8(GND)
HDMI1_5V: D4.2(C) JH1.18(+5V_POWER) R6#2.2 R17#2.2
VCC3V3: L1.1
VCC_3.3V: C60.1 L1.2 R1h.1 R1h.2 R1h.3 R1h.4 R7#2.2 R8#2.2 R9h.1 R9h.2 R9h.3 R9h.4 R15#2.2 R18#2.2 R19h.2
HDMI1_CLK_N: C61.1 JH1.12(CLK-) U2h.5(IN4) U2h.6(OUT4)
HDMI1_CLK_P: C62.1 JH1.10(CLK+) U2h.4(IN3) U2h.7(OUT3)
HDMI1_D0_N: C63.1 JH1.9(DATA0-) U2h.2(IN2) U2h.9(OUT2)
HDMI1_D0_P: C64.1 JH1.7(DATA0+) U2h.1(IN1) U2h.10(OUT1)
HDMI1_D1_N: C68.1 JH1.6(DAT1A-) U1h.5(IN4) U1h.6(OUT4)
HDMI1_D1_P: C67.1 JH1.4(DATA1+) U1h.4(IN3) U1h.7(OUT3)
HDMI1_D2_N: C65.1 JH1.3(DATA2-) U1h.2(IN2) U1h.9(OUT2)
HDMI1_D2_P: C66.1 JH1.1(DATA2+) U1h.1(IN1) U1h.10(OUT1)
HDMI1_FPGA_CEC: D3.K JH1.13(CEC) U3h.1(IN1) U3h.10(OUT1)
HDMI1_FPGA_CLK_N: C61.2 R1h.8
HDMI1_FPGA_CLK_P: C62.2 R1h.7
HDMI1_FPGA_D0_N: C63.2 R1h.6
HDMI1_FPGA_D0_P: C64.2 R1h.5
HDMI1_FPGA_D1_N: C68.2 R9h.5
HDMI1_FPGA_D1_P: C67.2 R9h.6
HDMI1_FPGA_D2_N: C65.2 R9h.8
HDMI1_FPGA_D2_P: C66.2 R9h.7
HDMI1_FPGA_HPD: JH1.19(HOT_PLUG) U3h.5(IN4) U3h.6(OUT4)
HDMI1_FPGA_SCL: Q1.2(S) R8#2.1
HDMI1_FPGA_SDA: Q2.2(S) R19h.1
HDMI1_SCL: JH1.15(SCL) Q1.3(D) R6#2.1 U3h.2(IN2) U3h.9(OUT2)
HDMI1_SDA: JH1.16(SDA) Q2.3(D) R17#2.1 U3h.4(IN3) U3h.7(OUT3)
NetD3_A: D3.A R15#2.1
NetQ1_1: Q1.1(G) R7#2.1
NetQ2_1: Q2.1(G) R18#2.1

Not connected (* = marked no-connect by the designer): JH1 14(NC)

### Layout directives
differential pair: HDMI1_CLK_N, HDMI1_CLK_P, HDMI1_D0_N, HDMI1_D0_P, HDMI1_D1_N, HDMI1_D1_P, HDMI1_D2_N, HDMI1_D2_P, HDMI1_FPGA_CLK_N, HDMI1_FPGA_CLK_P, HDMI1_FPGA_D0_N, HDMI1_FPGA_D0_P, HDMI1_FPGA_D1_N, HDMI1_FPGA_D1_P, HDMI1_FPGA_D2_N, HDMI1_FPGA_D2_P

### Notes on the sheet
- FPGA PIN: K19
- FPGA PIN: J19
- FPGA PIN: M19
- FPGA PIN: M20
- FPGA PIN: L19
- FPGA PIN: L20
- FPGA PIN: K17
- FPGA PIN: K18
- FPGA PIN: M14
- FPGA PIN: N15
- FPGA PIN: N16
- FPGA PIN: M15
- 利用二极管的单向导通设计HDMI供电可以往外输出或者输入
- ProjectName:
- TechWeb:
- Page Title:
- 米联客
- www.uisrc.com
- MSXBO
- Rev:
- 20191012
- Date:
- -
- Sheet
- 10    of     16

### Library data of the parts
C60 = CAPACITOR: Generic Capacitor; Value: 4.7uF; DPN: *; Manufacturer: *
C61-C68 = C0402
D3 = DIODE-SCH: Schotkey Diode NOT GENERIC; DPN: *; Manufacturer: *
D4 = 1N5817
L1 = INDUCTOR1: TC2: 0; DIELECTRIC: DSMAX; CURRENT: LMAX; PSpiceTemplate: L^@REFDES %1 %2 ?TOLERANCE|L^@REFDES| @VALUE ?IC/IC=@IC/ ?TOLERANCE|\n.model l^@REFDES IND L=1 DEV=@TOLERANCE% TC1=@TC1 TC2=@TC2 IL1=@IL1 IL2=@IL2|; DIST: FLAT; TC1: 0; IL2: 0; IL1: 0; Value: FB
Q1 Q2 = AO3400: PSpiceTemplate: X^@REFDES %d %g %s @MODEL
R1h R9h = RA-4
R6#2 R7#2 R8#2 R15#2 R17#2 R18#2 R19h = RES1: DIST: FLAT; PSpiceTemplate: R^@REFDES %1 %2 ?TOLERANCE|R^@REFDES| @VALUE TC=@TC1,@TC2 ?TOLERANCE|\n.model R^@REFDES RES R=1 DEV=@TOLERANCE% TC1=@TC1 TC2=@TC2|; VOLTAGE: RVMAX; SLOPE: RSMAX; MAX_TEMP: RTMAX; POWER: RMAX; TC1: 0; TC2: 0
  R6#2 R8#2 R17#2 R19h: Value: 2.2K
  R7#2 R18#2: Value: 10K
  R15#2: Value: 27K

## Sheet 15_PMU.SchDoc: MIZ7035_16_PMU
size A3; Revision: V1.0; SheetNumber: 15; SheetTotal: 17
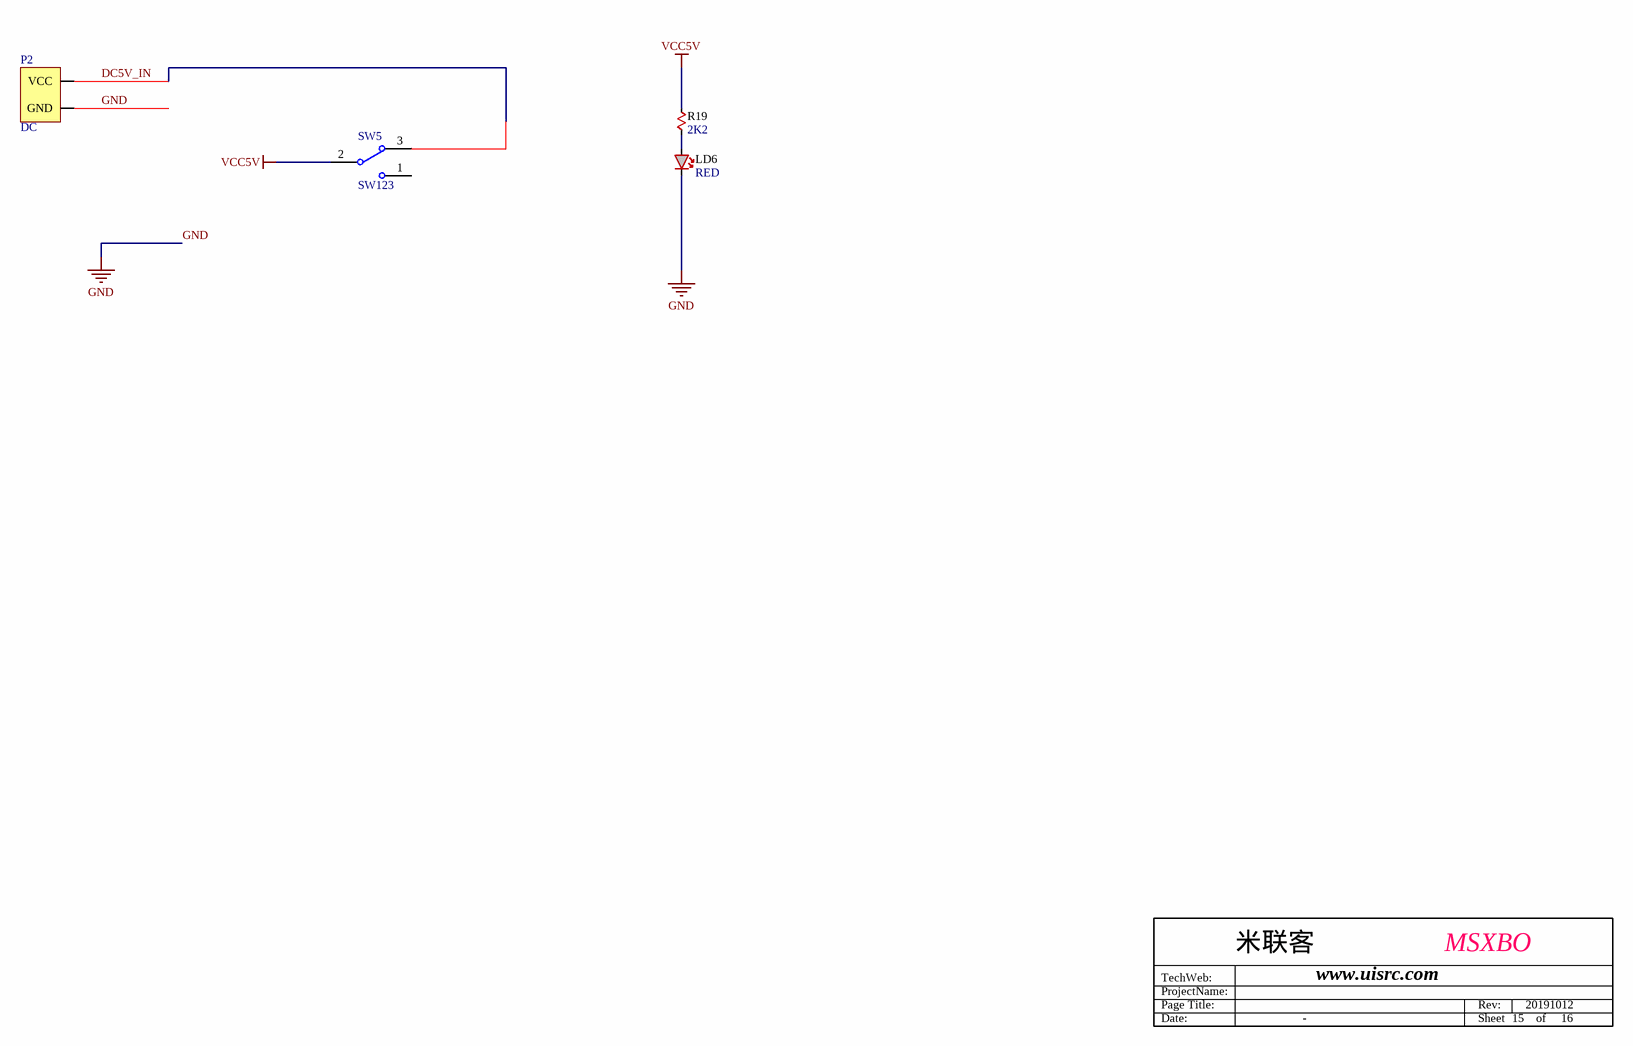
[diagram p10: 15_PMU.SchDoc]

### Parts
LD6  value RED  [D0603]  (hidden comment: LED)
P2  DC  [DC5.0]
R19  2K2  [R0603]
SW5  SW123  [SW1-2-3 -B]

### Nets
GND: LD6.K P2.2(GND)
VCC5V: R19.1 SW5.2
DC5V_IN: P2.1(VCC) SW5.3
NetLD6_A: LD6.A R19.2

Not connected (* = marked no-connect by the designer): SW5 1

### Notes on the sheet
- ProjectName:
- TechWeb:
- Page Title:
- 米联客
- www.uisrc.com
- MSXBO
- Rev:
- 20191012
- Date:
- -
- Sheet
- 15    of     16
- Title
- Size:
- A3
- Number:
- Time:
- Revision:
- of
- File:

### Library data of the parts
LD6 = LED: Generic LED; Manufacturer: *; DPN: *
R19 = RESISTOR: Generic Resistor; Value: 390; Manufacturer: *; DPN: *

## Nets that join several sheets
GND: 02_connector (61 pins), 05_USB_JTAG (J1.6), 06_TF_CARD (13 pins), 07_PS_ETH_RJ45 (5 pins), 11_BTN_LED_GPIO (10 pins), 12_PLCLK_100M (C13.2 IC2.2), 13_CEP (CEP1.19 CEP2.19), Sheet1 (14 pins), Sheet2 (32 pins), 10_HDMI_OUT (16 pins), 15_PMU (LD6.K P2.2)
VCC3V3: 02_connector (HT1.B30 HT1.B31 HT1.B32), 05_USB_JTAG (J1.4), 06_TF_CARD (7 pins), 07_PS_ETH_RJ45 (J4.11), 11_BTN_LED_GPIO (P1.1 R2.2), 12_PLCLK_100M (C13.1 IC2.4), 13_CEP (CEP1.20 CEP2.20), 10_HDMI_OUT (L1.1)
VCC5V: 02_connector (8 pins), Sheet2 (C18.2 U6.4 U6.6), 10_HDMI_OUT (D4.1), 15_PMU (R19.1 SW5.2)
VCC_ADJ: 02_connector (HT2.B43 HT2.B44 HT2.B45), 11_BTN_LED_GPIO (R5.2 R7#1.2)
ADC_3.3V: Sheet1 (12 pins), Sheet2 (C19.1 R20.1 R21.2 U6.1)
B34_L1_N: 02_connector (HT2.A27), 13_CEP (CEP2.9)
B34_L1_P: 02_connector (HT2.A28), 13_CEP (CEP2.8)
B34_L3_N: 02_connector (HT2.A23), 13_CEP (CEP2.13)
B34_L3_P: 02_connector (HT2.A24), 13_CEP (CEP2.12)
B34_L5_N: 02_connector (HT2.A21), 13_CEP (CEP2.15)
B34_L5_P: 02_connector (HT2.A22), 13_CEP (CEP2.14)
B34_L6_N: 02_connector (HT2.A25), 13_CEP (CEP2.11)
B34_L6_P: 02_connector (HT2.A26), 13_CEP (CEP2.10)
B34_L7_N: 02_connector (HT2.B7), 11_BTN_LED_GPIO (R5.1 SW2.1)
B34_L7_P: 02_connector (HT2.B8), 11_BTN_LED_GPIO (R7#1.1 SW3.1)
B34_L12_N: 02_connector (HT2.A12), 13_CEP (CEP1.14)
B34_L12_P: 02_connector (HT2.A13), 13_CEP (CEP1.15)
B34_L13_N: 02_connector (HT2.A9), 13_CEP (CEP1.12)
B34_L13_P: 02_connector (HT2.A10), 13_CEP (CEP1.13)
B34_L14_N: 02_connector (HT2.A5), 13_CEP (CEP1.8)
B34_L14_P: 02_connector (HT2.A6), 13_CEP (CEP1.9)
B34_L15_N: 02_connector (HT2.A3), 13_CEP (CEP1.6)
B34_L15_P: 02_connector (HT2.A4), 13_CEP (CEP1.7)
B34_L16_N: 02_connector (HT2.B3), 11_BTN_LED_GPIO (P1.6)
B34_L16_P: 02_connector (HT2.B4), 11_BTN_LED_GPIO (P1.5)
B34_L17_N: 02_connector (HT2.B5), 11_BTN_LED_GPIO (P1.4)
B34_L17_P: 02_connector (HT2.B6), 11_BTN_LED_GPIO (P1.3)
B34_L19_N: 02_connector (HT2.A16), 13_CEP (CEP1.18)
B34_L19_P: 02_connector (HT2.A17), 13_CEP (CEP2.18)
B34_L20_N: 02_connector (HT2.A14), 13_CEP (CEP1.16)
B34_L20_P: 02_connector (HT2.A15), 13_CEP (CEP1.17)
B34_L23_N: 02_connector (HT2.A7), 13_CEP (CEP1.10)
B34_L23_P: 02_connector (HT2.A8), 13_CEP (CEP1.11)
B34_L24_N: 02_connector (HT2.A18), 13_CEP (CEP2.17)
B34_L24_P: 02_connector (HT2.A19), 13_CEP (CEP2.16)
B35_L3_N: 02_connector (HT3.B29), 13_CEP (CEP1.5)
B35_L3_P: 02_connector (HT3.B30), 13_CEP (CEP1.4)
B35_L13_P: 02_connector (HT3.B23), 12_PLCLK_100M (R18#1.1)
BTN0: 02_connector (HT1.B3), 11_BTN_LED_GPIO (R2.1 SW1.1)
CLK1: 02_connector (HT2.B40), Sheet1 (U4.12)
CLK2: 02_connector (HT2.B34), Sheet1 (U5.12)
CON25: 02_connector (HT2.A31), 13_CEP (CEP2.6)
CON26: 02_connector (HT2.A33), 13_CEP (CEP2.4)
CON27: 02_connector (HT2.A35), 13_CEP (CEP2.2)
CON33: 02_connector (HT2.A30), 13_CEP (CEP2.7)
CON34: 02_connector (HT2.A32), 13_CEP (CEP2.5)
CON35: 02_connector (HT2.A34), 13_CEP (CEP2.3)
CON36: 02_connector (HT2.A36), 13_CEP (CEP2.1)
CS1: 02_connector (HT2.B39), Sheet1 (U4.11)
CS2: 02_connector (HT2.B33), Sheet1 (U5.11)
DAT1: 02_connector (HT2.B37), Sheet1 (U4.10)
DAT2: 02_connector (HT2.B32), Sheet1 (U5.10)
DOUT1: 02_connector (HT2.B41), Sheet1 (U4.13)
DOUT2: 02_connector (HT2.B42), Sheet1 (U4.14)
DOUT3: 02_connector (HT2.B35), Sheet1 (U5.13)
DOUT4: 02_connector (HT2.B36), Sheet1 (U5.14)
ETH-TD0_N: 02_connector (HT1.A7), 07_PS_ETH_RJ45 (J4.3)
ETH-TD0_P: 02_connector (HT1.A6), 07_PS_ETH_RJ45 (J4.2)
ETH-TD1_N: 02_connector (HT1.A9), 07_PS_ETH_RJ45 (J4.7)
ETH-TD1_P: 02_connector (HT1.A8), 07_PS_ETH_RJ45 (J4.4)
ETH-TD2_N: 02_connector (HT1.A14), 07_PS_ETH_RJ45 (J4.6)
ETH-TD2_P: 02_connector (HT1.A13), 07_PS_ETH_RJ45 (J4.5)
ETH-TD3_N: 02_connector (HT1.A16), 07_PS_ETH_RJ45 (J4.9)
ETH-TD3_P: 02_connector (HT1.A15), 07_PS_ETH_RJ45 (J4.8)
ETH_LDA: 02_connector (HT1.B8), 07_PS_ETH_RJ45 (J4.14)
ETH_LDB: 02_connector (HT1.B9), 07_PS_ETH_RJ45 (J4.12)
HDMI1_FPGA_CEC: 02_connector (HT3.B7), 10_HDMI_OUT (D3.K JH1.13 U3h.1 U3h.10)
HDMI1_FPGA_CLK_N: 02_connector (HT3.A11), 10_HDMI_OUT (C61.2 R1h.8)
HDMI1_FPGA_CLK_P: 02_connector (HT3.A12), 10_HDMI_OUT (C62.2 R1h.7)
HDMI1_FPGA_D0_N: 02_connector (HT3.A6), 11_BTN_LED_GPIO (R4.2), 10_HDMI_OUT (C63.2 R1h.6)
HDMI1_FPGA_D0_P: 02_connector (HT3.A7), 11_BTN_LED_GPIO (R3.2), 10_HDMI_OUT (C64.2 R1h.5)
HDMI1_FPGA_D1_N: 02_connector (HT3.A4), 11_BTN_LED_GPIO (R8#1.2), 10_HDMI_OUT (C68.2 R9h.5)
HDMI1_FPGA_D1_P: 02_connector (HT3.A5), 11_BTN_LED_GPIO (R6#1.2), 10_HDMI_OUT (C67.2 R9h.6)
HDMI1_FPGA_D2_N: 02_connector (HT3.B13), 10_HDMI_OUT (C65.2 R9h.8)
HDMI1_FPGA_D2_P: 02_connector (HT3.B14), 10_HDMI_OUT (C66.2 R9h.7)
HDMI1_FPGA_HPD: 02_connector (HT3.B6), 10_HDMI_OUT (JH1.19 U3h.5 U3h.6)
HDMI1_FPGA_SCL: 02_connector (HT3.B5), 10_HDMI_OUT (Q1.2 R8#2.1)
HDMI1_FPGA_SDA: 02_connector (HT3.B4), 10_HDMI_OUT (Q2.2 R19h.1)
LED5: 02_connector (HT1.B2), 11_BTN_LED_GPIO (R9.2)
PS_RST: 02_connector (HT1.B37), 11_BTN_LED_GPIO (SW4.1)
R_CLK: 02_connector (HT2.A39), Sheet2 (J6.28)
R_DAT: 02_connector (HT2.A41), Sheet2 (J6.32)
R_LEP: 02_connector (HT2.A40), Sheet2 (J6.30)
R_LER: 02_connector (HT2.A37), Sheet2 (J6.26)
R_MUX: 02_connector (HT2.A42), Sheet2 (J6.36)
R_TXD: 02_connector (HT2.A43), Sheet2 (J6.38)
RIN1: Sheet1 (U4.1), Sheet2 (J7.1)
RIN2: Sheet1 (U4.8), Sheet2 (J7.3)
RIN3: Sheet1 (U5.1), Sheet2 (J7.5)
RIN4: Sheet1 (U5.8), Sheet2 (J7.7)
SD_CCLK: 02_connector (HT1.A26), 06_TF_CARD (R15#1.2)
SD_CD: 02_connector (HT1.A27), 06_TF_CARD (R14.1)
SD_CMD: 02_connector (HT1.A24), 06_TF_CARD (IC1.4)
SD_D0: 02_connector (HT1.A30), 06_TF_CARD (IC1.6)
SD_D1: 02_connector (HT1.A29), 06_TF_CARD (IC1.7)
SD_D2: 02_connector (HT1.A28), 06_TF_CARD (IC1.1)
SD_D3: 02_connector (HT1.A25), 06_TF_CARD (IC1.3)
TCK-JTAG: 02_connector (HT1.A36), 05_USB_JTAG (J1.1)
TDI-JTAG: 02_connector (HT1.A34), 05_USB_JTAG (J1.3)
TDO-JTAG: 02_connector (HT1.A35), 05_USB_JTAG (J1.5)
TMS-JTAG: 02_connector (HT1.A37), 05_USB_JTAG (J1.2)
VCC1V8: 02_connector (HT1.B24 HT1.B25 HT1.B26), 06_TF_CARD (C8.1 IC1.5)